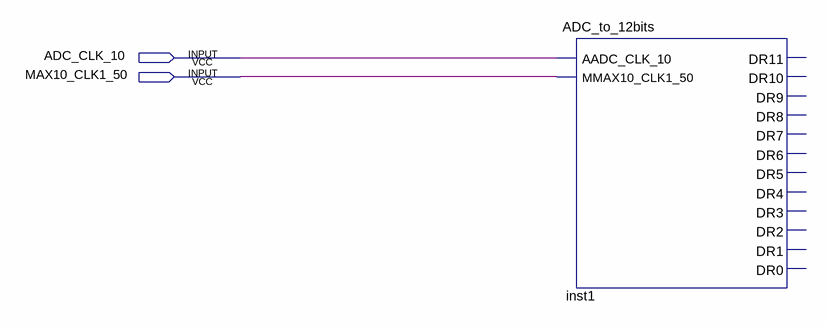
[diagram p0: schematic sheet]
// Quartus schematic hello-adc.bdf as structural Verilog: 1 symbols, 2 pins
module \hello-adc  (
  input  ADC_CLK_10,
  input  MAX10_CLK1_50
);

  ADC_to_12bits inst1 (
    .AADC_CLK_10(ADC_CLK_10), .MMAX10_CLK1_50(MAX10_CLK1_50));  // open: DR11, DR10, DR9, DR8, DR7, DR6, DR5, DR4, DR3, DR2, DR1, DR0
endmodule
